# Altium project Core.PrjPCB
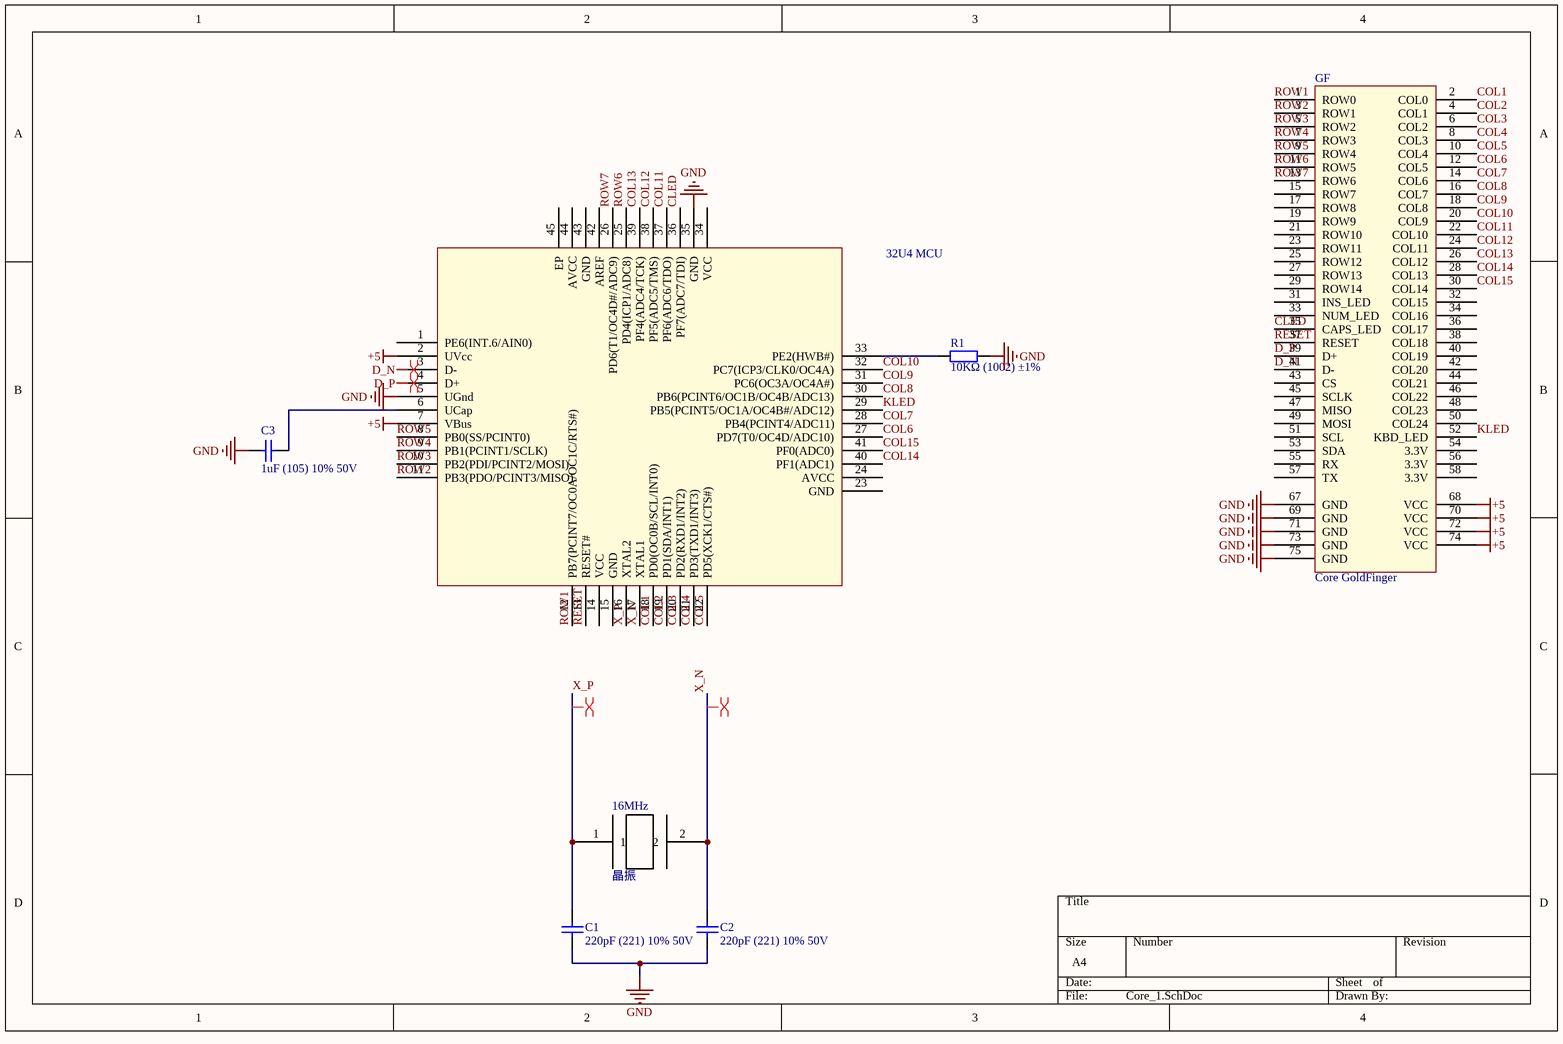
[diagram p0: Core_1.SchDoc]
1 sheet, 7 parts. Net scope: global (net labels, ports and power ports of the same name join across sheets).
Board file: PCB1.PcbDoc

## Sheet Core_1.SchDoc
size A4

### Parts
16MHz  晶振  [OSC-SMD_2P-L5.0-W3.2]
C1  220pF (221) 10% 50V  [1206_C]
C2  220pF (221) 10% 50V  [1206_C]
C3  1uF (105) 10% 50V  [1206_C]
GF  Core GoldFinger  [Core GoldFinger]
R1  10KΩ (1002) ±1%  [1206_R]
  32U4 MCU  [32U4]

### Nets
+5: GF.68(VCC) GF.70(VCC) GF.72(VCC) GF.74(VCC) .2(UVcc) .7(VBus)
GND: C1.2 C2.2 C3.1 GF.67(GND) GF.69(GND) GF.71(GND) GF.73(GND) GF.75(GND) R1.2 .5(UGnd) .35(GND)
CLED: GF.35(CAPS_LED) .36(PF7(ADC7/TDI))
COL1: GF.2(COL0) .18(PD0(OC0B/SCL/INT0))
COL2: GF.4(COL1) .19(PD1(SDA/INT1))
COL3: GF.6(COL2) .20(PD2(RXD1/INT2))
COL4: GF.8(COL3) .21(PD3(TXD1/INT3))
COL5: GF.10(COL4) .22(PD5(XCK1/CTS#))
COL6: GF.12(COL5) .27(PD7(T0/OC4D/ADC10))
COL7: GF.14(COL6) .28(PB4(PCINT4/ADC11))
COL8: GF.16(COL7) .30(PB6(PCINT6/OC1B/OC4B/ADC13))
COL9: GF.18(COL8) .31(PC6(OC3A/OC4A#))
COL10: GF.20(COL9) .32(PC7(ICP3/CLK0/OC4A))
COL11: GF.22(COL10) .37(PF6(ADC6/TDO))
COL12: GF.24(COL11) .38(PF5(ADC5/TMS))
COL13: GF.26(COL12) .39(PF4(ADC4/TCK))
COL14: GF.28(COL13) .40(PF1(ADC1))
COL15: GF.30(COL14) .41(PF0(ADC0))
D_N: GF.41(D-) .3(D-)
D_P: GF.39(D+) .4(D+)
KLED: GF.52(KBD_LED) .29(PB5(PCINT5/OC1A/OC4B#/ADC12))
RESET: GF.37(RESET) .13(RESET#)
ROW1: GF.1(ROW0) .12(PB7(PCINT7/OC0A/OC1C/RTS#))
ROW2: GF.3(ROW1) .11(PB3(PDO/PCINT3/MISO))
ROW3: GF.5(ROW2) .10(PB2(PDI/PCINT2/MOSI))
ROW4: GF.7(ROW3) .9(PB1(PCINT1/SCLK))
ROW5: GF.9(ROW4) .8(PB0(SS/PCINT0))
ROW6: GF.11(ROW5) .25(PD4(ICP1/ADC8))
ROW7: GF.13(ROW6) .26(PD6(T1/OC4D#/ADC9))
X_N: 16MHz.2 C2.1 .17(XTAL1)
X_P: 16MHz.1 C1.1 .16(XTAL2)
NetC3_2: C3.2 .6(UCap)
NetR1_1: R1.1 .33(PE2(HWB#))

Not connected (* = marked no-connect by the designer): GF 15(ROW7) 17(ROW8) 19(ROW9) 21(ROW10) 23(ROW11) 25(ROW12) 27(ROW13) 29(ROW14) 31(INS_LED) 32(COL15) 33(NUM_LED) 34(COL16) 36(COL17) 38(COL18) 40(COL19) 42(COL20) 43(CS) 44(COL21) 45(SCLK) 46(COL22) 47(MISO) 48(COL23) 49(MOSI) 50(COL24) 51(SCL) 53(SDA) 54(3.3V) 55(RX) 56(3.3V) 57(TX) 58(3.3V);  1(PE6(INT.6/AIN0)) 14(VCC) 15(GND) 23(GND) 24(AVCC) 34(VCC) 42(AREF) 43(GND) 44(AVCC) 45(EP)

### Layout directives
differential pair: D_N, D_P, X_N, X_P

### Library data of the parts
C1 C2 = 1206 220pF (221) 10% 50V: 贴片电容; ComponentLink1Description: 供应商链接; ComponentLink1URL: http://www.szlcsc.com/product/details_2206.html; Package: 1206; Supplier: LC; SuppliersPartNumber: C1854
C3 = 1206 1uF (105) 10% 50V: 贴片电容; ComponentLink1Description: 供应商链接; ComponentLink1URL: http://www.szlcsc.com/product/details_2200.html; Package: 1206; Supplier: LC; SuppliersPartNumber: C1848
R1 = 1206 10KΩ (1002) 1%: 贴片电阻; ComponentLink1Description: 供应商链接; ComponentLink1URL: http://www.szlcsc.com/product/details_18590.html; Package: 1206; Supplier: LC; SuppliersPartNumber: C17902